# Altium schematic sheet [X] - USB.SchDoc
size 513 x 386 mm
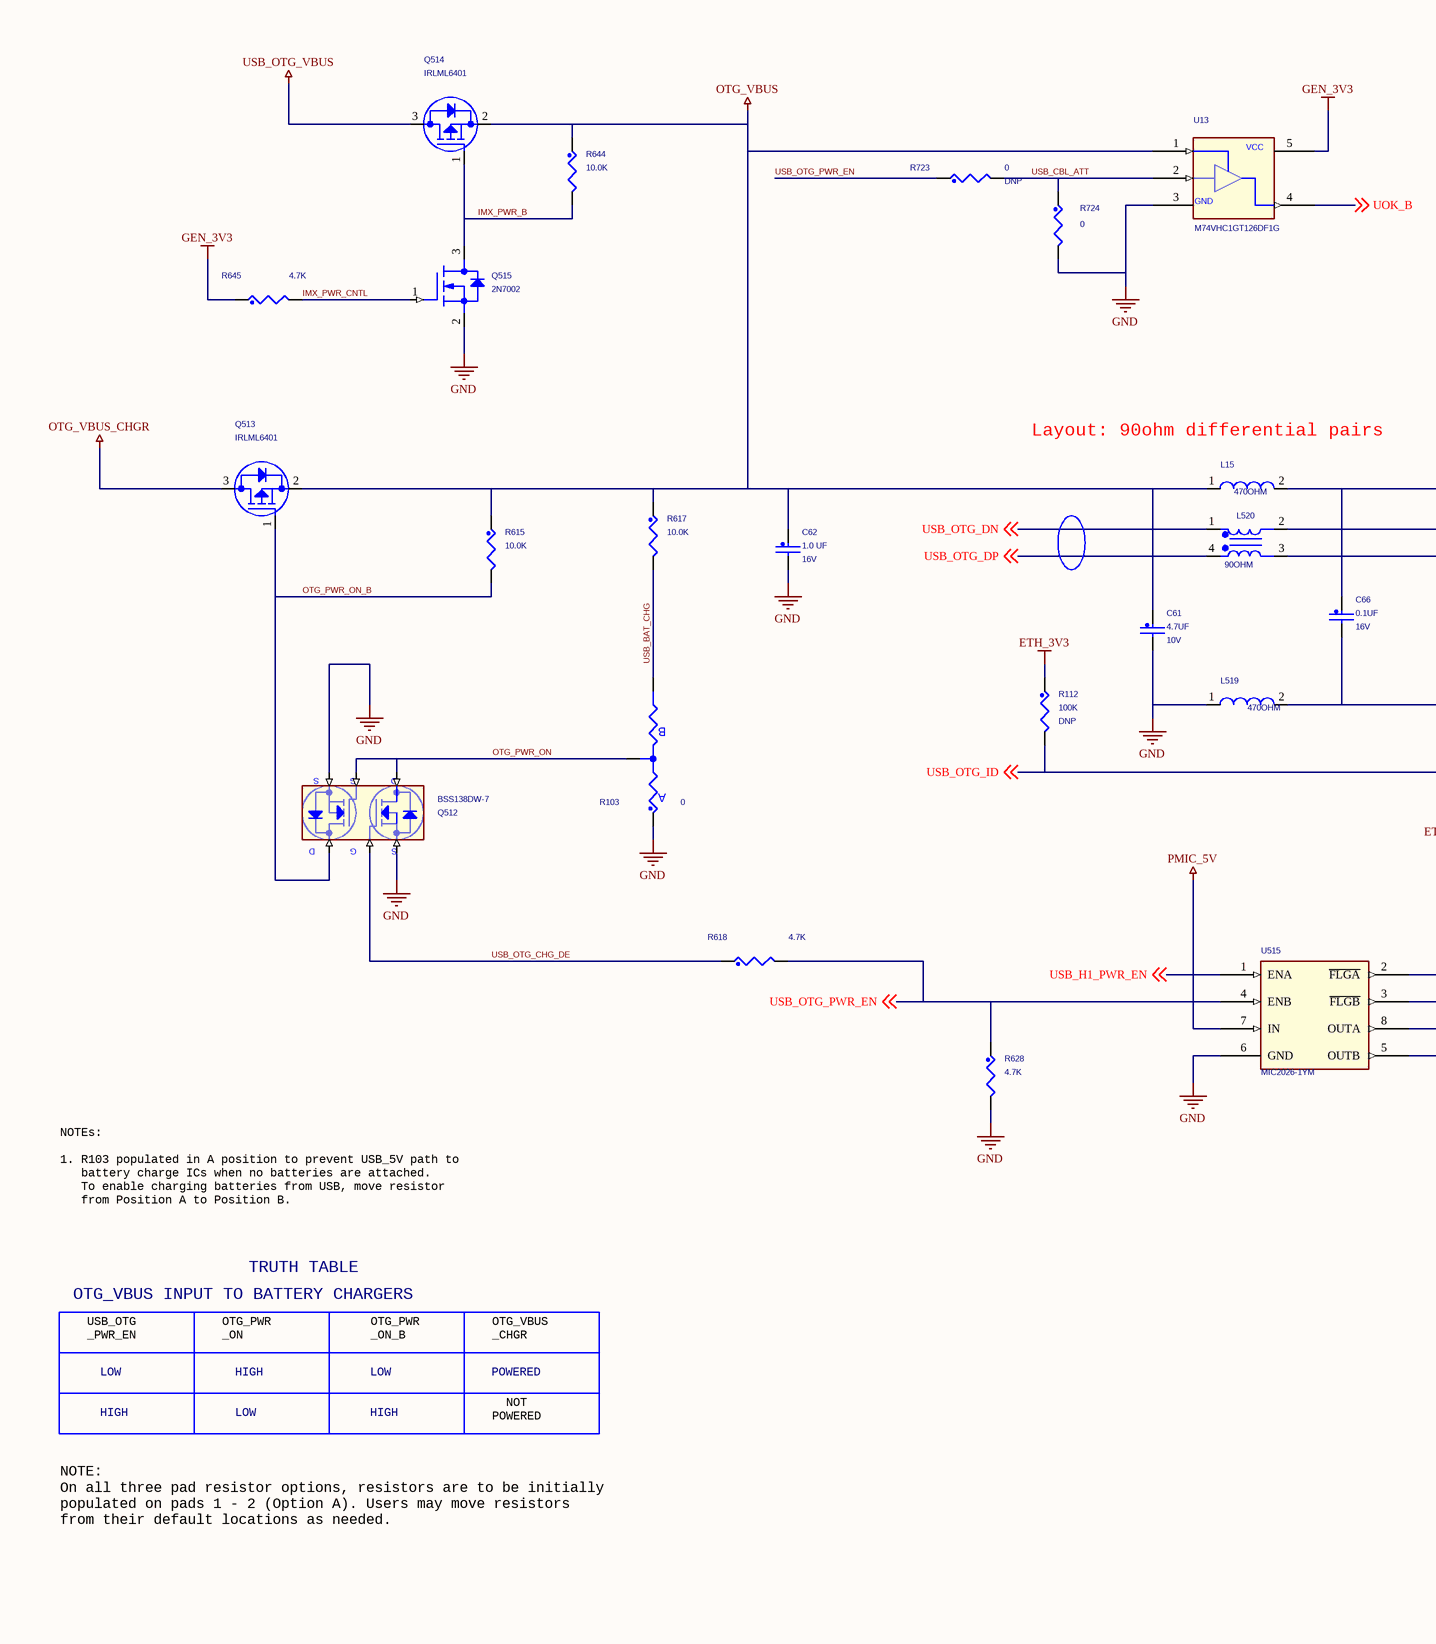
[diagram p0: [X] - USB.SchDoc, left]
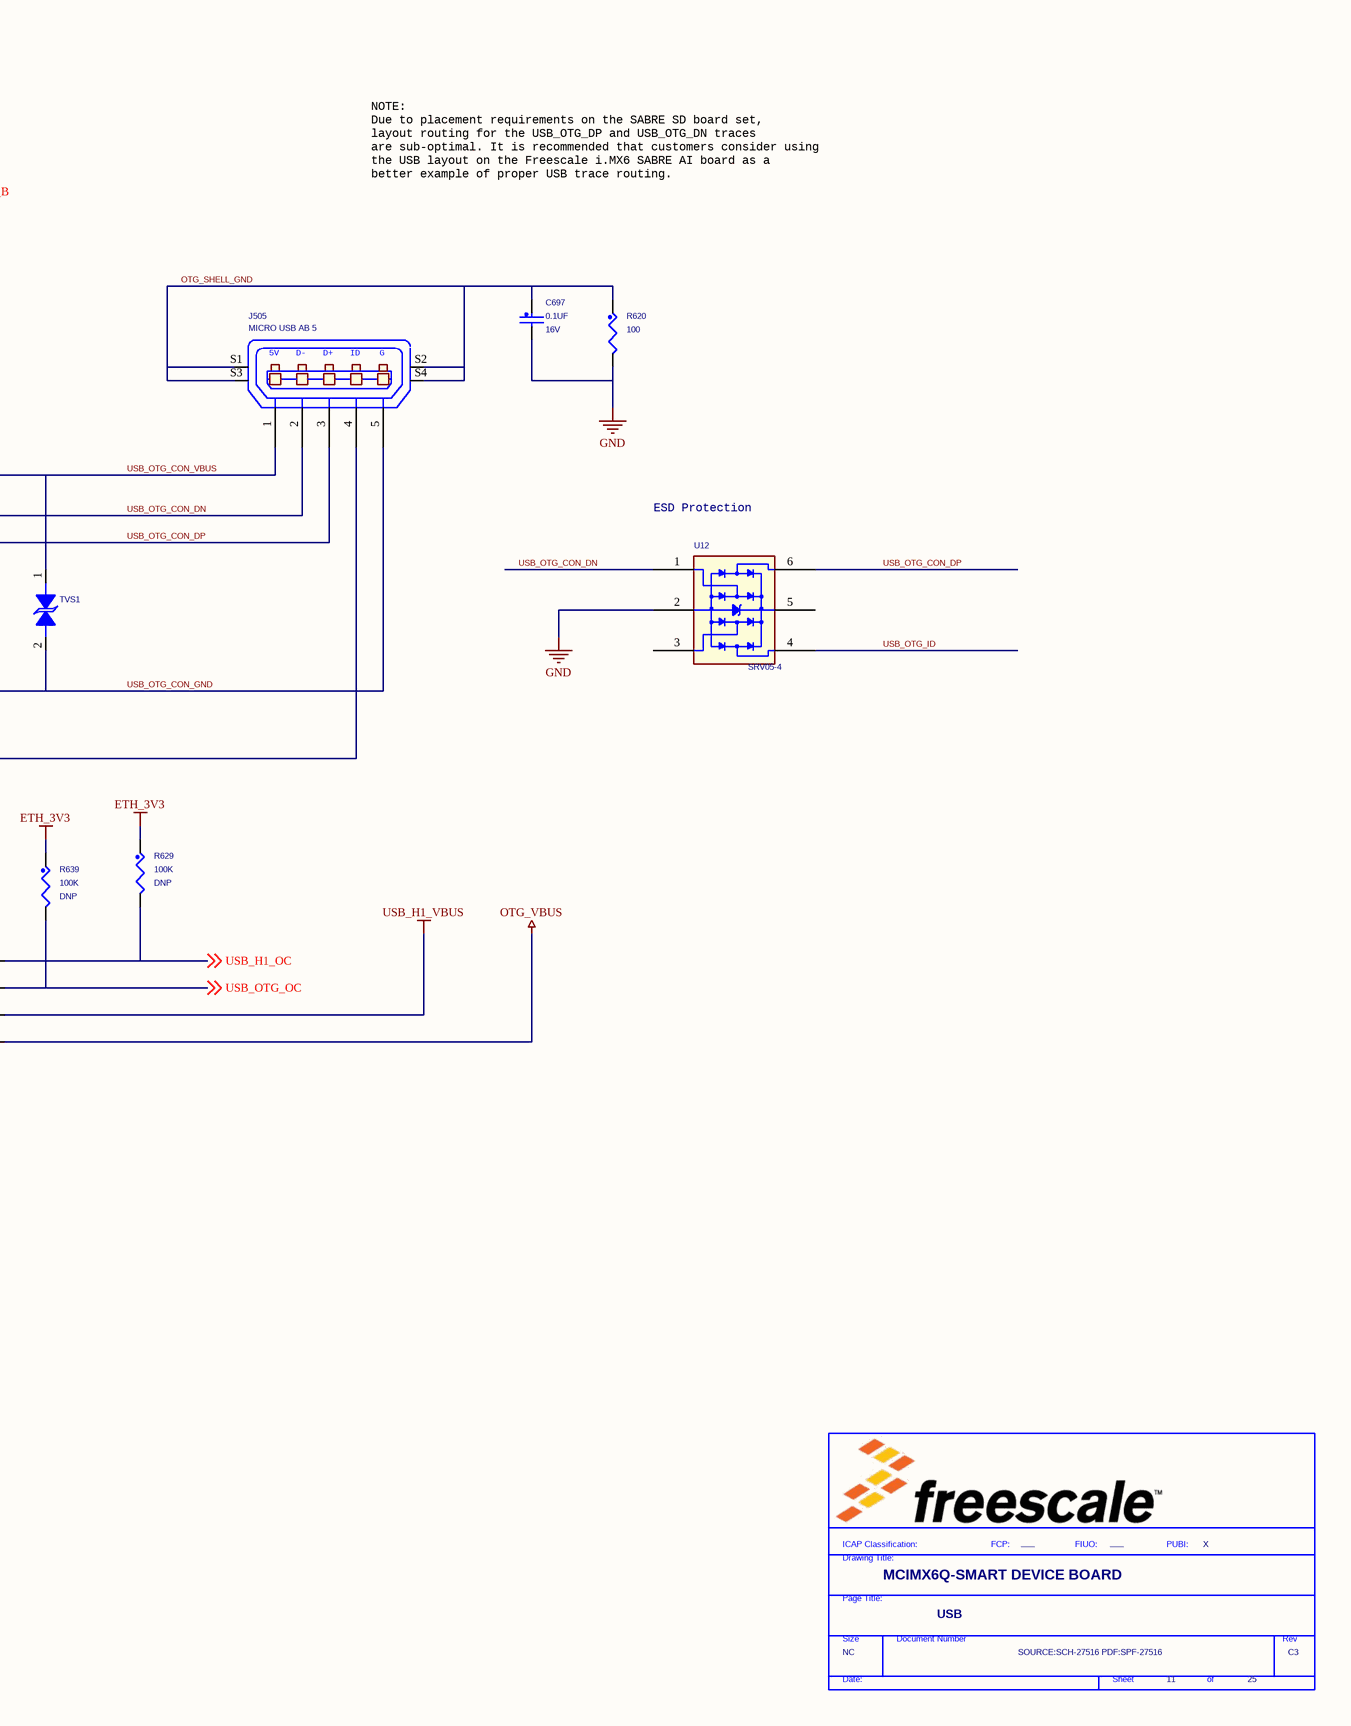
[diagram p1: [X] - USB.SchDoc, right]

## Parts
*  FIUO: ___  PUBI: X  Doc: SOURCE:SCH-27516 PDF:SPF-27516  RevCode: C3  Title: MCIMX6Q-SMART DEVICE BOARD  Page Size: NC  Page Number: 11  Page Count: 25  PageTitle: USB  (hidden comment: TitleBlock_FS)  (graphical)
C61  4.7UF  WVDC: 10V  [0603_CC]
C62  1.0 UF  WVDC: 16V  [0603_CC]
C66  0.1UF  WVDC: 16V  [0402_CC]
C697  0.1UF  WVDC: 16V  [0402_CC]
J505  MICRO USB AB 5  [con5_microusb]
L15  470OHM  [0603_CC]
L519  470OHM  [0603_CC]
L520  90OHM  [ind4_choke_0805]
Q512  BSS138DW-7  [sc70-6]
Q513  IRLML6401  [sot-23]
Q514  IRLML6401  [sot-23]
Q515  2N7002  [SOT23]
R103  0  [R603-X2]
R112  100K  ASSY_OPT: DNP  [0402_CC]
R615  10.0K  [0402_CC]
R617  10.0K  [0402_CC]
R618  4.7K  [0402_CC]
R620  100  [0402_CC]
R628  4.7K  [0402_CC]
R629  100K  ASSY_OPT: DNP  [0402_CC]
R639  100K  ASSY_OPT: DNP  [0402_CC]
R644  10.0K  [0402_CC]
R645  4.7K  [0402_CC]
R723  0  ASSY_OPT: DNP  [0402_CC]
R724  0  [0402_CC]
TVS1  ESD9B3.3ST5G  [SOD-923_NP]  (value not drawn)
U12  SRV05-4  [SOT23_S6]
U13  M74VHC1GT126DF1G  [SOT353]
U515  MIC2026-1YM  [SO8]

## Nets
ETH_3V3: R112.1 R629.1 R639.1
GEN_3V3: R645.1 U13.5(VCC)
GND: C61.2 C62.2 C697.2 L519.1 Q512.1(SOURCE2) Q512.4(SOURCE1) Q515.2(SOURCE) R103.1 R620.2 R628.2 R724.2 U12.2(GND) U13.3(GND) U515.6(GND)
OTG_VBUS: C61.1 C62.1 L15.1 Q513.2(SOURCE) Q514.2(SOURCE) R615.1 R617.1 R644.1 U13.1(OE) U515.5(OUTB)
OTG_VBUS_CHGR: Q513.3(DRAIN)
PMIC_5V: U515.7(IN)
USB_H1_VBUS: U515.8(OUTA)
USB_OTG_VBUS: Q514.3(DRAIN)
IMX_PWR_B: Q514.1(GATE) Q515.3(DRAIN) R644.2
IMX_PWR_CNTL: Q515.1(GATE) R645.2
OTG_PWR_ON: Q512.2(GATE2) Q512.3(DRAIN1) R103.2
OTG_PWR_ON_B: Q512.6(DRAIN2) Q513.1(GATE) R615.2
OTG_SHELL_GND: C697.1 J505.S1(SHLD1) J505.S2(SHLD2) J505.S3(SHLD3) J505.S4(SHLD4) R620.1
UOK_B: U13.4(Y) ; off-sheet UOK_B
USB_BAT_CHG: R103.3 R617.2
USB_CBL_ATT: R723.2 R724.1 U13.2(A)
USB_H1_OC: R629.2 U515.2(~{FLGA}) ; off-sheet USB_H1_OC
USB_H1_PWR_EN: U515.1(ENA) ; off-sheet USB_H1_PWR_EN
USB_OTG_CHG_DE: Q512.5(GATE1) R618.1
USB_OTG_CON_DN: J505.2(P2) L520.2 U12.1(I/O1)
USB_OTG_CON_DP: J505.3(P3) L520.3 U12.6(I/O6)
USB_OTG_CON_GND: C66.2 J505.5(P5) L519.2 TVS1.2(A2)
USB_OTG_CON_VBUS: C66.1 J505.1(P1) L15.2 TVS1.1(A1)
USB_OTG_DN: L520.1 ; off-sheet USB_OTG_DN
USB_OTG_DP: L520.4 ; off-sheet USB_OTG_DP
USB_OTG_ID: J505.4(P4) R112.2 U12.4(I/O4) ; off-sheet USB_OTG_ID
USB_OTG_OC: R639.2 U515.3(~{FLGB}) ; off-sheet USB_OTG_OC
USB_OTG_PWR_EN: R618.2 R628.1 R723.1 U515.4(ENB) ; off-sheet USB_OTG_PWR_EN

Not connected (* = marked no-connect by the designer): U12 3(I/O3) 5(VCC)

## Notes on the sheet
- NOTE:
  Due to placement requirements on the SABRE SD board set,
  layout routing for the USB_OTG_DP and USB_OTG_DN traces
  are sub-optimal. It is recommended that customers consider using
  the USB layout on the Freescale i.MX6 SABRE AI board as a
  better example of proper USB trace routing.
- (near L15) Layout: 90ohm differential pairs
- ESD Protection
- NOTEs:
  1. R103 populated in A position to prevent USB_5V path to
  battery charge ICs when no batteries are attached.
  To enable charging batteries from USB, move resistor
  from Position A to Position B.
- TRUTH TABLE
- OTG_VBUS INPUT TO BATTERY CHARGERS
- USB_OTG
  _PWR_EN
- OTG_PWR
  _ON
- OTG_PWR
  _ON_B
- OTG_VBUS
  _CHGR
- LOW
- HIGH
- POWERED
- NOT
  POWERED
- NOTE:
  On all three pad resistor options, resistors are to be initially
  populated on pads 1 - 2 (Option A). Users may move resistors
  from their default locations as needed.
- (in symbol MOSFET_2N_CHAN) S; G; D
- (in symbol RES_0603_X2) B; A
- (in symbol TitleBlock_FS) ICAP Classification:; FCP:; FIUO:; PUBI:; Drawing Title:; Page Title:; Size; Document Number; Rev; Date:; Sheet; of
- (in symbol USB_MINI_AB_RECEPTACLE) 5V; D-; D+; ID; G

## Library data of the parts
* = TitleBlock_FS: OrgAddr2: Austin, TX 78735-8598; OrgAddr1: 6501 William Cannon Drive West; OrgName: Freescale Semiconductor; FCP: ___; Page Create Date: March  8, 1995
C61 = CAP_NP: CAP CER 4.7UF 10V 10% X5R 0603; CLASS: DISCRETE; AGILE_PN: 150-77975; MFG_NAME01: TAIYO YUDEN; MFG_PN01: LMK107BJ475KA-T; CAD_APPROVED: Yes; FPLIST: CC0603_OV,CC0603,0603_CC; SIGNAL_MODEL: DEFAULT_CAPACITOR_4.7e+06pF_2_1; Tolerance: 10%; TOL: 10%; ROHS: Yes; HEIGHT: 0.9MM; VOLTAGE: 10V
C62 = CAP_NP: CAP CER 1.0UF 16V 10% X7R 0603; CLASS: DISCRETE; FPLIST: CC0603_OV,CC0603,0603_CC; CAD_APPROVED: Yes; MFG_PN01: 0603YC105KAT2A; MFG_NAME01: AVX; AGILE_PN: 150-30028; SIGNAL_MODEL: DEFAULT_CAPACITOR_1e+06pF_2_1; HEIGHT: 1.0MM; ROHS: Yes; Tolerance: 10%; VOLTAGE: 16V
C66 C697 = CAP_NP: CAP CER 0.1UF 16V 10% X7R 0402; CLASS: DISCRETE; FPLIST: CC0402_25,CC0402_HD,0402_CC; CAD_APPROVED: Yes; MFG_PN01: C0402C104K4RAC; MFG_NAME01: KEMET; AGILE_PN: 150-75182; SIGNAL_MODEL: DEFAULT_CAPACITOR_100000pF_2_1; HEIGHT: 0.635MM; ROHS: Yes; Tolerance: 10%; VOLTAGE: 16V
J505 = USB_MINI_AB_RECEPTACLE: CON 1X5 USB_MICRO_AB_RECEPTACLE RA SMT 0.65MM SP 105H AU; CLASS: IO; AGILE_PN: 211-78722; MFG_NAME01: Molex; MFG_PN01: 47589-0001; CAD_APPROVED: Yes; FPLIST: con5_microusb,con5_microusb_cust; ROHS: Yes; HEIGHT: 2.65MM
L15 L519 = INDUCTOR: IND FER BEAD 470OHM@100MHZ 500MA 25% 0603; CLASS: DISCRETE; AGILE_PN: 180-76158; MFG_NAME01: MURATA; MFG_PN01: BLM18EG471SN1D; CAD_APPROVED: Yes; FPLIST: IND_0603,0603_CC; Tolerance: 25%; ROHS: Yes; HEIGHT: 0.95MM; PART_TYPE: INDUCTOR
L520 = DLW43: IND CHK 90 OHM@100MHZ 330MA 25% 0805; PART_TYPE: CHOKE; CLASS: DISCRETE; CAD_APPROVED: Yes; MFG_PN01: DLW21HN900SQ2L; MFG_NAME01: MURATA; AGILE_PN: 180-76336; HEIGHT: 1MM; ROHS: Yes; Tolerance: 25%
Q512 = MOSFET_2N_CHAN: TRAN NMOS DUAL 200MA 50V SOT363; CLASS: IC; CAD_APPROVED: Yes; MFG_PN01: BSS138DW-7-F; MFG_NAME01: Diodes Inc; AGILE_PN: 480-76911; HEIGHT: 1.1MM; ROHS: Yes
Q513 Q514 = MOSFET_P: TRAN PMOS PWR 12V 4.3A SOT23; CLASS: IC; AGILE_PN: 480-77718; MFG_NAME01: INTERNATIONAL RECTIFIER; MFG_PN01: IRLML6401TRPBF; CAD_APPROVED: Yes; ROHS: Yes; HEIGHT: 1.12MM
Q515 = 2N7002: TRAN NMOS 60V 115MA SOT23; CLASS: IC; CAD_APPROVED: Yes; MFG_PN01: 2N7002LT1G; MFG_NAME01: ON SEMICONDUCTOR; AGILE_PN: 480-75159; HEIGHT: 1.3MM; ROHS: Yes
R103 = RES_0603_X2: RES MF ZERO OHM 1/10W -- 0603; CLASS: DISCRETE; FPLIST: RC0603_OV,RC0603,R603-X2,0603_CC; CAD_APPROVED: Yes; MFG_PN01: CRCW06030000Z0EA; MFG_NAME01: VISHAY INTERTECHNOLOGY; Tolerance: 1%; AGILE_PN: 470-75407; ROHS: Yes
R112 = RES: RES MF 100K 1/16W 1% 0402; CLASS: DISCRETE; FPLIST: RC0402_25,RC0402_HD,0402_CC; CAD_APPROVED: Yes; MFG_PN01: RK73H1ETTP1003F; MFG_NAME01: KOA SPEER; AGILE_PN: 470-76240; SIGNAL_MODEL: DEFAULT_RESISTOR_100000OHM_2_1; ROHS: Yes; Tolerance: 1%
R615 = RES: RES MF 10.0K 1/16W 1% 0402; CLASS: DISCRETE; SIGNAL_MODEL: DEFAULT_RESISTOR_10000OHM_2_1; FPLIST: RC0402_25,RC0402_HD,0402_CC; CAD_APPROVED: Yes; MFG_PN01: CRCW040210K0FKED; MFG_NAME01: VISHAY INTERTECHNOLOGY; AGILE_PN: 470-75416; ROHS: Yes; Tolerance: 1%
R617 = RES: RES MF 10.0K 1/16W 1% 0402; CLASS: DISCRETE; SIGNAL_MODEL: DEFAULT_RESISTOR_10000OHM_2_1; AGILE_PN: 470-75416; MFG_NAME01: VISHAY INTERTECHNOLOGY; MFG_PN01: CRCW040210K0FKED; CAD_APPROVED: Yes; FPLIST: RC0402_25,RC0402_HD,0402_CC; Tolerance: 1%; ROHS: Yes
R618 R645 = RES: RES MF 4.70K 1/16W 1% 0402; CLASS: DISCRETE; FPLIST: RC0402_25,RC0402_HD,0402_CC; CAD_APPROVED: Yes; MFG_PN01: RK73H1ETTP4701F; MFG_NAME01: KOA SPEER; AGILE_PN: 470-75418; SIGNAL_MODEL: DEFAULT_RESISTOR_4700OHM_2_1; ROHS: Yes; Tolerance: 1%
R620 = RES: RES MF 100 OHM 1/16W 1% 0402; CLASS: DISCRETE; AGILE_PN: 470-30454; MFG_NAME01: THYE MING TECH CO LTD; MFG_PN01: CR-02FL6--100R; CAD_APPROVED: Yes; FPLIST: RC0402_25,RC0402_HD,0402_CC; SIGNAL_MODEL: DEFAULT_RESISTOR_100OHM_2_1; Tolerance: 1%; ROHS: Yes
R628 = RES: RES MF 4.70K 1/16W 1% 0402; CLASS: DISCRETE; AGILE_PN: 470-75418; MFG_NAME01: KOA SPEER; MFG_PN01: RK73H1ETTP4701F; CAD_APPROVED: Yes; FPLIST: RC0402_25,RC0402_HD,0402_CC; SIGNAL_MODEL: DEFAULT_RESISTOR_4700OHM_2_1; Tolerance: 1%; ROHS: Yes
R629 R639 = RES: RES MF 100K 1/16W 1% 0402; CLASS: DISCRETE; AGILE_PN: 470-76240; MFG_NAME01: KOA SPEER; MFG_PN01: RK73H1ETTP1003F; CAD_APPROVED: Yes; FPLIST: RC0402_25,RC0402_HD,0402_CC; SIGNAL_MODEL: DEFAULT_RESISTOR_100000OHM_2_1; Tolerance: 1%; ROHS: Yes
R644 = RES: RES MF 10.0K 1/16W 1% 0402; CLASS: DISCRETE; FPLIST: RC0402_25,RC0402_HD,0402_CC; CAD_APPROVED: Yes; MFG_PN01: CRCW040210K0FKED; MFG_NAME01: VISHAY INTERTECHNOLOGY; AGILE_PN: 470-75416; SIGNAL_MODEL: DEFAULT_RESISTOR_10000OHM_2_1; ROHS: Yes; Tolerance: 1%
R723 = RES: RES MF ZERO OHM 1/10W -- 0402; CLASS: DISCRETE; SIGNAL_MODEL: DEFAULT_RESISTOR_0.001OHM_2_1; AGILE_PN: 470-79965; MFG_NAME01: Panasonic; MFG_PN01: ERJ-2GE0R00X; CAD_APPROVED: Yes; FPLIST: RC0402_25,RC0402_HD,RC0402_X2,0402_CC; PRIORITY_PN: 006-00559; ROOM: HDMI; ROHS: Yes
R724 = RES: RES MF ZERO OHM 1/10W -- 0402; CLASS: DISCRETE; ROOM: HDMI; PRIORITY_PN: 006-00559; FPLIST: RC0402_25,RC0402_HD,RC0402_X2,0402_CC; CAD_APPROVED: Yes; MFG_PN01: ERJ-2GE0R00X; MFG_NAME01: Panasonic; AGILE_PN: 470-79965; SIGNAL_MODEL: DEFAULT_RESISTOR_0.001OHM_2_1; ROHS: Yes
TVS1 = DIODE_TVS_BIDIR: DIODE TVS LOW CAP 3.3V SOD-923; CLASS: IC; CAD_APPROVED: Yes; MFG_NAME01: On Semiconductor; AGILE_PN: 480-77957; HEIGHT: 0.4MM; ROHS: Yes; MFG_PN01: ESD9B3.3ST5G
U12 = SRV05-4: DIODE TVS ARRAY 12A 5V 300W SOT23_S6; CLASS: IC; CAD_APPROVED: Yes; MFG_PN01: SRV05-4.TCT; MFG_NAME01: SEMTECH CORP; AGILE_PN: 480-75205; HEIGHT: 1.45mm; ROHS: Yes
U13 = 1G126: IC BUFF CMOS LVL/SFTR N-I SOT353; AGILE_PN: 312-79742; MFG_NAME01: On Semiconductor; CAD_APPROVED: Yes; CLASS: IC; MFG_PN01: M74VHC1GT126DF1G; ROHS: Yes; HEIGHT: 1.1mm
U515 = MIC2526_8P: IC LIN SW PWR ACTIVE HIGH DUAL 2.7V-5.5V 0.5A SOIC8; AGILE_PN: 312-75936; MFG_NAME01: MICREL; CAD_APPROVED: Yes; CLASS: IC; MFG_PN01: MIC2026-1YM; ROHS: Yes; HEIGHT: 1.73mm